# Altium schematic sheet LEDs.SchDoc
size A4
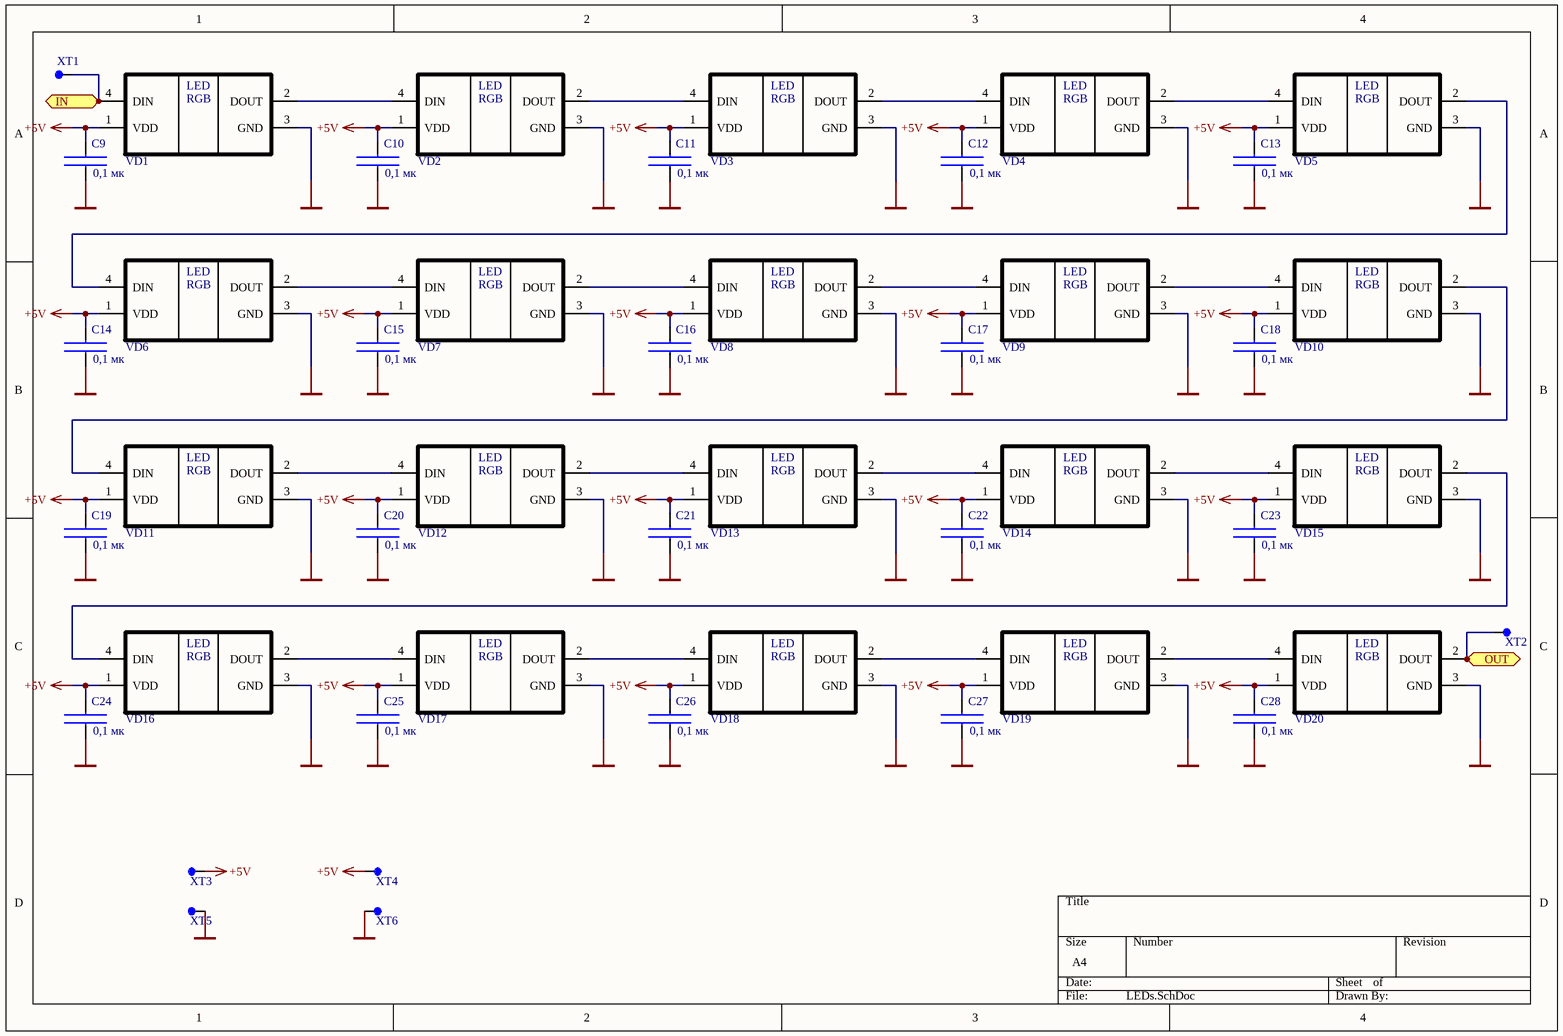
[diagram p0: LEDs.SchDoc]

## Parts
C9  0,1 мк  [CC1608(0603)x09]
C10  0,1 мк  [CC1608(0603)x09]
C11  0,1 мк  [CC1608(0603)x09]
C12  0,1 мк  [CC1608(0603)x09]
C13  0,1 мк  [CC1608(0603)x09]
C14  0,1 мк  [CC1608(0603)x09]
C15  0,1 мк  [CC1608(0603)x09]
C16  0,1 мк  [CC1608(0603)x09]
C17  0,1 мк  [CC1608(0603)x09]
C18  0,1 мк  [CC1608(0603)x09]
C19  0,1 мк  [CC1608(0603)x09]
C20  0,1 мк  [CC1608(0603)x09]
C21  0,1 мк  [CC1608(0603)x09]
C22  0,1 мк  [CC1608(0603)x09]
C23  0,1 мк  [CC1608(0603)x09]
C24  0,1 мк  [CC1608(0603)x09]
C25  0,1 мк  [CC1608(0603)x09]
C26  0,1 мк  [CC1608(0603)x09]
C27  0,1 мк  [CC1608(0603)x09]
C28  0,1 мк  [CC1608(0603)x09]
VD1  W2812B  [WS2812B]  (value not drawn)
VD2  W2812B  [WS2812B]  (value not drawn)
VD3  W2812B  [WS2812B]  (value not drawn)
VD4  W2812B  [WS2812B]  (value not drawn)
VD5  W2812B  [WS2812B]  (value not drawn)
VD6  W2812B  [WS2812B]  (value not drawn)
VD7  W2812B  [WS2812B]  (value not drawn)
VD8  W2812B  [WS2812B]  (value not drawn)
VD9  W2812B  [WS2812B]  (value not drawn)
VD10  W2812B  [WS2812B]  (value not drawn)
VD11  W2812B  [WS2812B]  (value not drawn)
VD12  W2812B  [WS2812B]  (value not drawn)
VD13  W2812B  [WS2812B]  (value not drawn)
VD14  W2812B  [WS2812B]  (value not drawn)
VD15  W2812B  [WS2812B]  (value not drawn)
VD16  W2812B  [WS2812B]  (value not drawn)
VD17  W2812B  [WS2812B]  (value not drawn)
VD18  W2812B  [WS2812B]  (value not drawn)
VD19  W2812B  [WS2812B]  (value not drawn)
VD20  W2812B  [WS2812B]  (value not drawn)
XT1  XT3  [XT3]  (value not drawn)
XT2  XT3  [XT3]  (value not drawn)
XT3  XT3  [XT3]  (value not drawn)
XT4  XT3  [XT3]  (value not drawn)
XT5  XT3  [XT3]  (value not drawn)
XT6  XT3  [XT3]  (value not drawn)

## Ports
IN, OUT

## Nets
+5V: C9.1 C10.1 C11.1 C12.1 C13.1 C14.1 C15.1 C16.1 C17.1 C18.1 C19.1 C20.1 C21.1 C22.1 C23.1 C24.1 C25.1 C26.1 C27.1 C28.1 VD1.1(VDD) VD2.1(VDD) VD3.1(VDD) VD4.1(VDD) VD5.1(VDD) VD6.1(VDD) VD7.1(VDD) VD8.1(VDD) VD9.1(VDD) VD10.1(VDD) VD11.1(VDD) VD12.1(VDD) VD13.1(VDD) VD14.1(VDD) VD15.1(VDD) VD16.1(VDD) VD17.1(VDD) VD18.1(VDD) VD19.1(VDD) VD20.1(VDD) XT3.1 XT4.1
GND: C9.2 C10.2 C11.2 C12.2 C13.2 C14.2 C15.2 C16.2 C17.2 C18.2 C19.2 C20.2 C21.2 C22.2 C23.2 C24.2 C25.2 C26.2 C27.2 C28.2 VD1.3(GND) VD2.3(GND) VD3.3(GND) VD4.3(GND) VD5.3(GND) VD6.3(GND) VD7.3(GND) VD8.3(GND) VD9.3(GND) VD10.3(GND) VD11.3(GND) VD12.3(GND) VD13.3(GND) VD14.3(GND) VD15.3(GND) VD16.3(GND) VD17.3(GND) VD18.3(GND) VD19.3(GND) VD20.3(GND) XT5.1 XT6.1
IN: VD1.4(DIN) XT1.1 ; port IN
OUT: VD20.2(DOUT) XT2.1 ; port OUT
NetVD1_2: VD1.2(DOUT) VD2.4(DIN)
NetVD2_2: VD2.2(DOUT) VD3.4(DIN)
NetVD3_2: VD3.2(DOUT) VD4.4(DIN)
NetVD4_2: VD4.2(DOUT) VD5.4(DIN)
NetVD5_2: VD5.2(DOUT) VD6.4(DIN)
NetVD6_2: VD6.2(DOUT) VD7.4(DIN)
NetVD7_2: VD7.2(DOUT) VD8.4(DIN)
NetVD8_2: VD8.2(DOUT) VD9.4(DIN)
NetVD9_2: VD9.2(DOUT) VD10.4(DIN)
NetVD10_2: VD10.2(DOUT) VD11.4(DIN)
NetVD11_2: VD11.2(DOUT) VD12.4(DIN)
NetVD12_2: VD12.2(DOUT) VD13.4(DIN)
NetVD13_2: VD13.2(DOUT) VD14.4(DIN)
NetVD14_2: VD14.2(DOUT) VD15.4(DIN)
NetVD15_2: VD15.2(DOUT) VD16.4(DIN)
NetVD16_2: VD16.2(DOUT) VD17.4(DIN)
NetVD17_2: VD17.2(DOUT) VD18.4(DIN)
NetVD18_2: VD18.2(DOUT) VD19.4(DIN)
NetVD19_2: VD19.2(DOUT) VD20.4(DIN)

## Notes on the sheet
- (in symbol W2812B) LED; RGB

## Library data of the parts
C9-C28 = CC0603 X7R uF0.22 V25/16: Ceramic Chip-capacitor 0603; Name: Конденсатор 0603-0.22 мкФ X7R 25/16V; Voltage: 25 / 16; Vendor1: AVX Corporation; Vendor2: KEMET Electronics Corporation, USA; Vendor2Name: C0603C224K3RAC (25V), C0603C224K4RAC (16V); Ta: -55+125; Vendor3: Murata Manufacturing Co., Ltd, Japan; Vendor3Name: GRM188R71E224K (25V), GRM188R71C224K (16V); Vendor4: Panasonic (Matsushita Electric Co.), Japan; Vendor4Name: ECJ1VB1C224K (16V); Vendor5: Samsung, Korea; Vendor5Name: CL10B224KO8NNNC (16V); Vendor6: Taiyo Yuden Co., Ltd., Japan; Vendor6Name: EMK107BJ224KA-T (16V); Vendor7: TDK Corp., Japan; Vendor7Name: C1608X7R1E224K (25V); Vendor8: Vishay Intertechnology, Inc., USA; Vendor8Name: VJ0603Y224KXJCW1BC (16V); Vendor9: Yageo Corp., Taiwan; Vendor9Name: CC0603KRX7R7BN224 / 2238 786 15654 (16V); Type: Capacitor; Vendor1Name: N/A